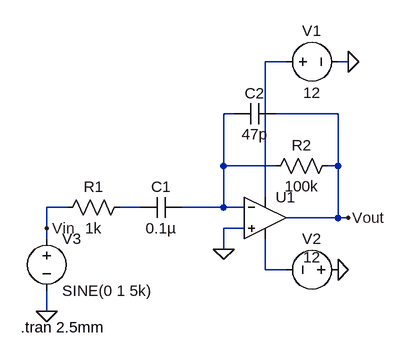
[diagram p0: schematic differentiator.asc]
differentiator.asc, the LTspice schematic file:
Version 4
SHEET 1 880 680
WIRE 240 -80 208 -80
WIRE 336 -80 320 -80
WIRE 160 0 144 0
WIRE 320 0 224 0
WIRE 144 80 144 0
WIRE 224 80 144 80
WIRE 320 80 320 0
WIRE 320 80 304 80
WIRE 208 128 208 -80
WIRE -96 144 -128 144
WIRE 16 144 -16 144
WIRE 144 144 144 80
WIRE 144 144 80 144
WIRE 176 144 144 144
WIRE 320 160 320 80
WIRE 320 160 240 160
WIRE 336 160 320 160
WIRE -128 176 -128 144
WIRE 176 176 144 176
WIRE -128 192 -128 176
WIRE 144 208 144 176
WIRE 208 240 208 192
WIRE 240 240 208 240
WIRE -128 304 -128 272
FLAG 320 240 0
FLAG 144 208 0
FLAG 336 -80 0
FLAG 336 160 Vout
FLAG -128 304 0
FLAG -128 176 Vin
SYMBOL voltage 336 240 R90
WINDOW 0 -32 56 VBottom 2
WINDOW 3 -4 56 VBottom 2
WINDOW 123 0 0 Left 0
WINDOW 39 0 0 Left 0
SYMATTR InstName V2
SYMATTR Value 12
SYMBOL OpAmps\\UniversalOpamp 208 160 R0
SYMATTR InstName U1
SYMBOL voltage 224 -80 R270
WINDOW 0 32 56 VTop 2
WINDOW 3 -32 56 VBottom 2
WINDOW 123 0 0 Left 0
WINDOW 39 0 0 Left 0
SYMATTR InstName V1
SYMATTR Value 12
SYMBOL cap 80 128 R90
WINDOW 0 0 32 VBottom 2
WINDOW 3 32 32 VTop 2
SYMATTR InstName C1
SYMATTR Value 0.1µ
SYMBOL res 0 128 R90
WINDOW 0 0 56 VBottom 2
WINDOW 3 32 56 VTop 2
SYMATTR InstName R1
SYMATTR Value 1k
SYMBOL voltage -128 176 R0
WINDOW 123 0 0 Left 0
WINDOW 39 0 0 Left 0
SYMATTR InstName V3
SYMATTR Value SINE(0 1 5k)
SYMBOL res 320 64 R90
WINDOW 0 0 56 VBottom 2
WINDOW 3 32 56 VTop 2
SYMATTR InstName R2
SYMATTR Value 100k
SYMBOL cap 224 -16 R90
WINDOW 0 0 32 VBottom 2
WINDOW 3 32 32 VTop 2
SYMATTR InstName C2
SYMATTR Value 47p
TEXT -168 328 Left 2 !.tran 2.5mm

The netlist it stands for:
* differentiator.asc
V2 0 N004 12
XU1 0 N002 N001 N004 Vout level1 Avol=1Meg GBW=10Meg Vos=0 En=0 Enk=0 In=0 Ink=0 Rin=500Meg  ; pins In+ In- V+ V- OUT
V1 N001 0 12
C1 N002 N003 0.1µ
R1 N003 Vin 1k
V3 Vin 0 SINE(0 1 5k)
R2 Vout N002 100k
C2 Vout N002 47p
.tran 2.5mm
.lib UniversalOpAmp1.lib
.backanno
.end